# Altium schematic sheet TIDA-010042-E2_Power Stage_Pg3.SchDoc: Power Stage
size 431 x 279 mm; Date: Not shown in title block; ApprovedBy: Not shown in title block; CheckedBy: Not shown in title block; Author: Not shown in title block; CompanyName: Not shown in title block; DrawnBy: Vaibhavi; Engineer: Not shown in title block; Organization: Not shown in title block; Address1: Not shown in title block; Address2: Not shown in title block; Address3: Not shown in title block; Address4: Not shown in title block; DocumentNumber: 1; Revision: Use project parameter SCH_Rev; SheetNumber: 3; SheetTotal: 5; PageSetup: Record=PageOptions|CenterHorizontal=True|CenterVertical=True|PrintScale=1.00|XCorrection=1.00|YCorrection=1.00|PrintKind=0|BorderSize=5000000|LeftOffset=0|BottomOffset=0|Orientation=2|PaperLength=1000|PaperWidth=1000|Scale=100|PaperSource=15|PrintQuality=600|MediaType=1|DitherType=10|PaperKind=Letter|PrintScaleMode=1; CurrentTime: Not shown in title block; CurrentDate: Not shown in title block; Time: Not shown in title block; DocumentFullPathAndName: Not shown in title block; DocumentName: Not shown in title block; ModifiedDate: Not shown in title block; ImagePath: Not shown in title block
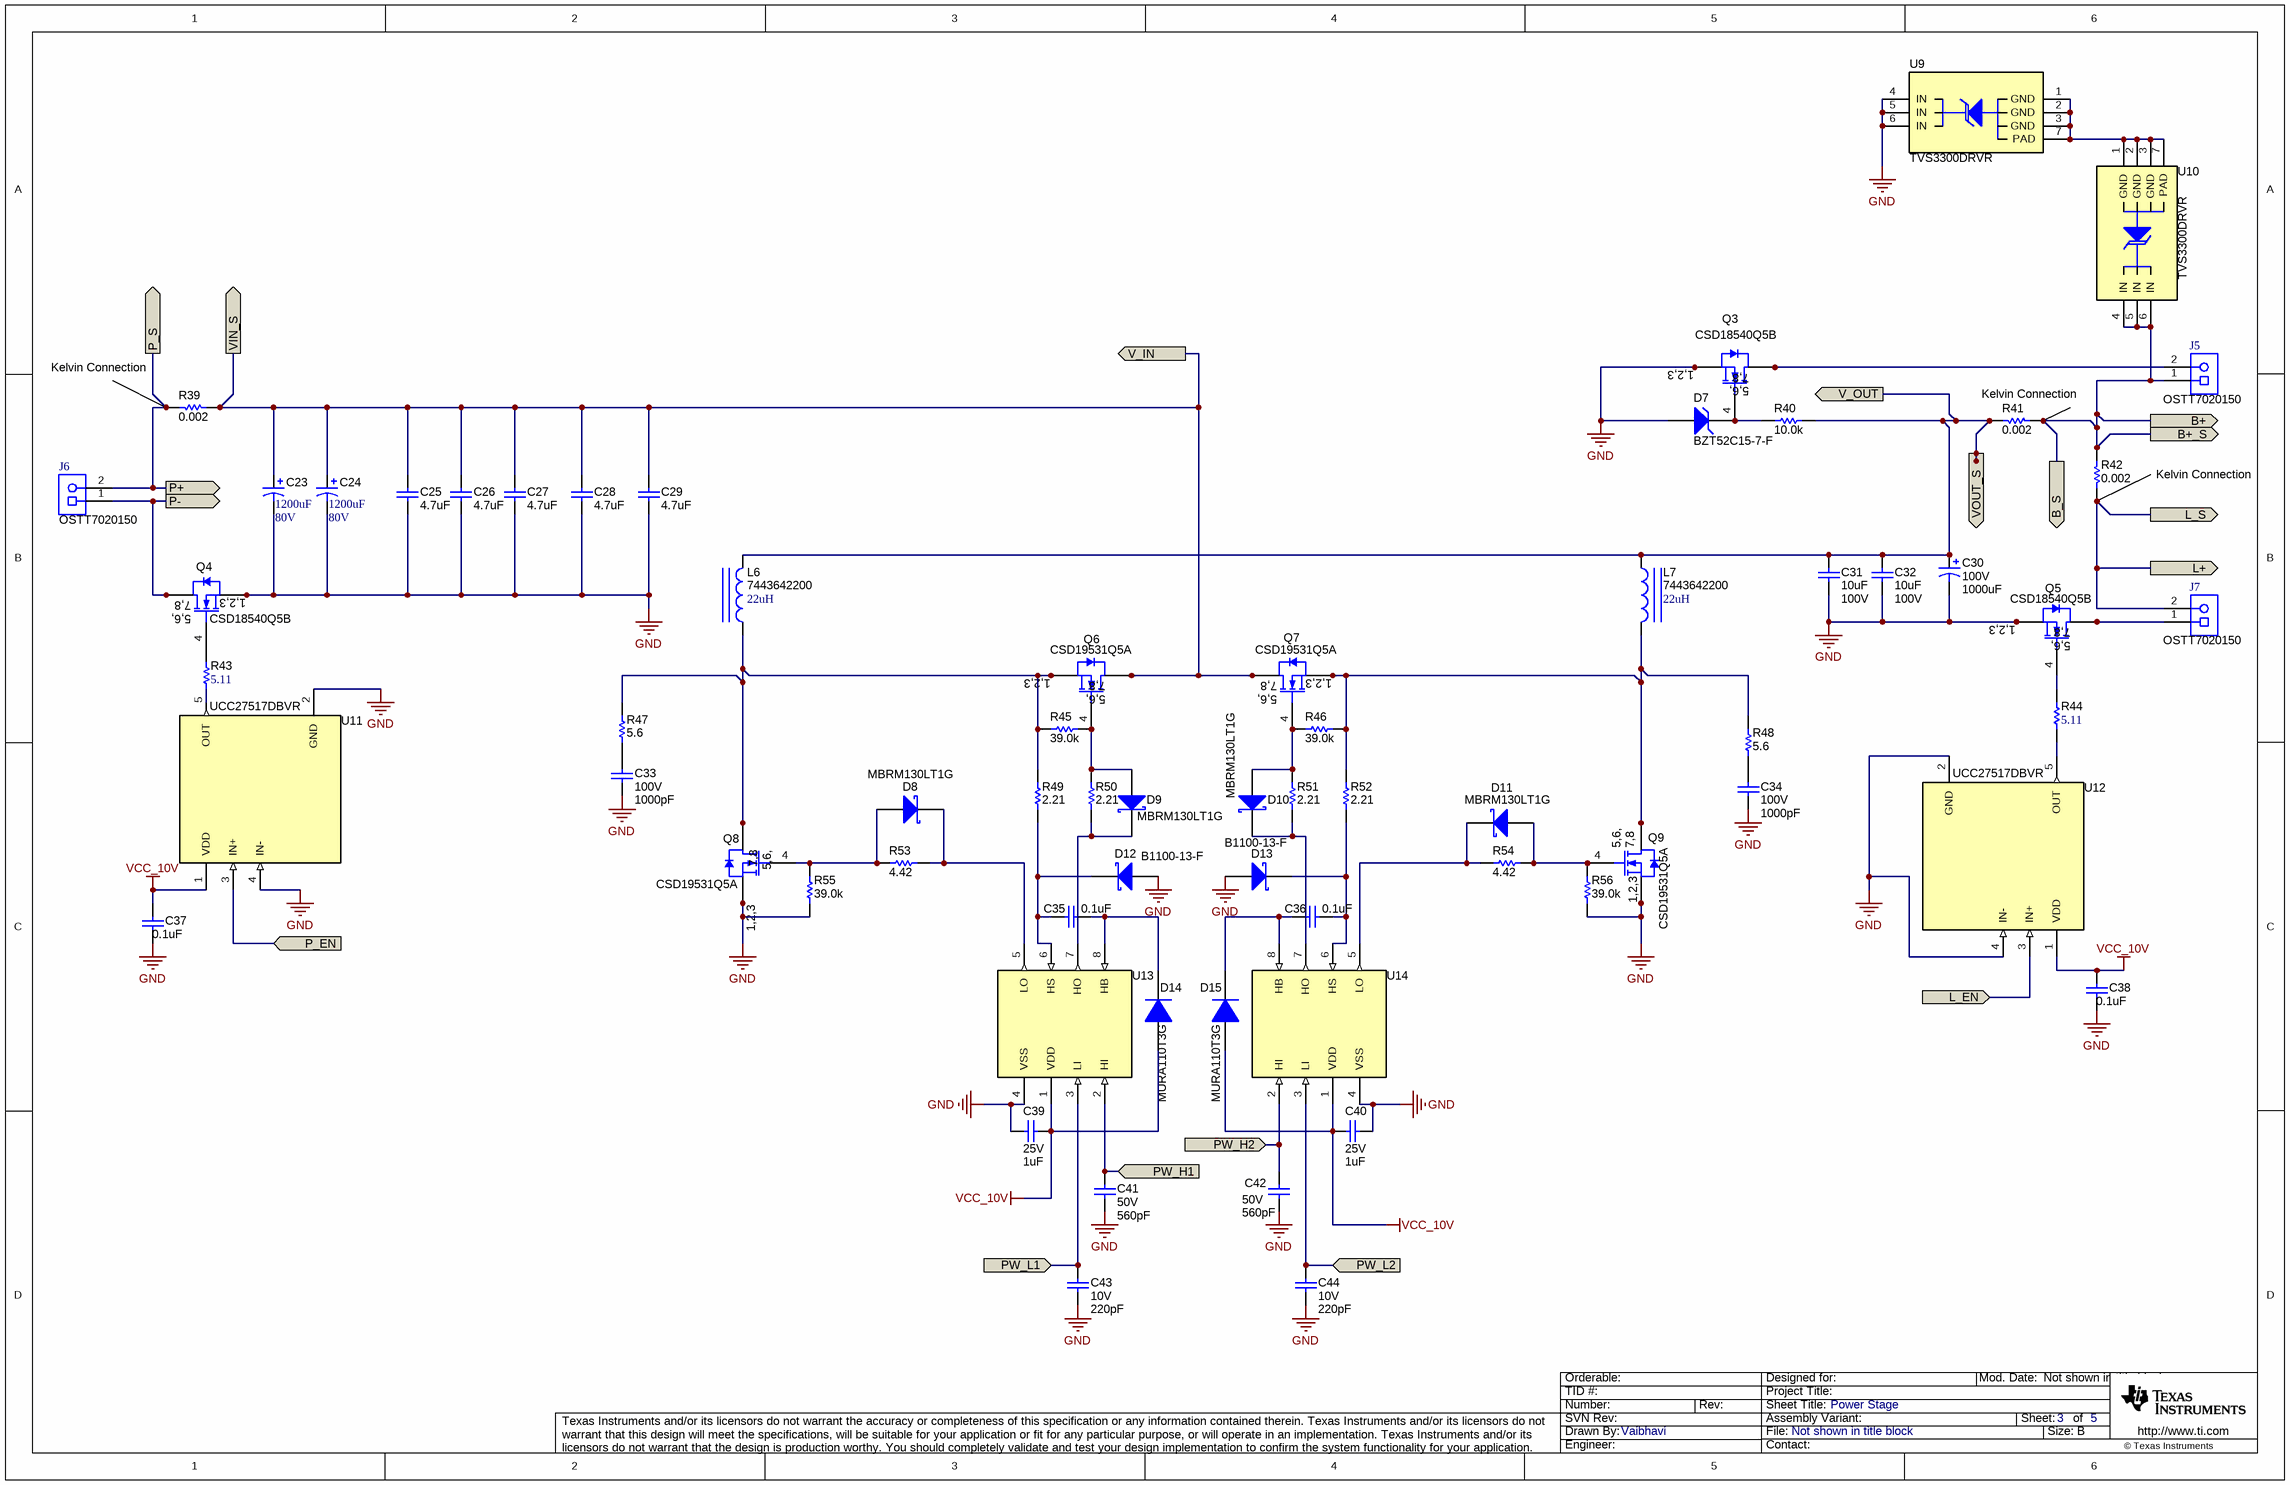
[diagram p0: TIDA-010042-E2_Power Stage_Pg3.SchDoc]

## Parts
C23  value 1200uF  VDC_V: 80V  [KYB_1800x3150]  (hidden comment: EKYB800ELL122MMN3S)
C24  value 1200uF  VDC_V: 80V  [KYB_1800x3150]  (hidden comment: EKYB800ELL122MMN3S)
C25  ValueDisplayed: 4.7uF  [2220_250]  (hidden comment: Capacitor)
C26  ValueDisplayed: 4.7uF  [2220_250]  (hidden comment: Capacitor)
C27  ValueDisplayed: 4.7uF  [2220_250]  (hidden comment: Capacitor)
C28  ValueDisplayed: 4.7uF  [2220_250]  (hidden comment: Capacitor)
C29  ValueDisplayed: 4.7uF  [2220_250]  (hidden comment: Capacitor)
C30  VDC_V: 100V  ValueDisplayed: 1000uF  [VR_1800x4000]  (hidden comment: UVR2A102MHD)
C31  ValueDisplayed: 10uF  VDC_V: 100V  [2220_280]  (hidden comment: 22201C106MAT2A)
C32  ValueDisplayed: 10uF  VDC_V: 100V  [2220_280]  (hidden comment: 22201C106MAT2A)
C33  VDC_V: 100V  ValueDisplayed: 1000pF  [0603]  (hidden comment: 06031C102JAT2A)
C34  VDC_V: 100V  ValueDisplayed: 1000pF  [0603]  (hidden comment: 06031C102JAT2A)
C35  ValueDisplayed: 0.1uF  [0805_HV]  (hidden comment: C0805C104K3RACAUTO)
C36  ValueDisplayed: 0.1uF  [0805_HV]  (hidden comment: C0805C104K3RACAUTO)
C37  ValueDisplayed: 0.1uF  [0603]  (hidden comment: GMK107BJ104KAHT)
C38  ValueDisplayed: 0.1uF  [0603]  (hidden comment: GMK107BJ104KAHT)
C39  VDC_V: 25V  ValueDisplayed: 1uF  [0805_HV]  (hidden comment: 08053C105KAT2A)
C40  VDC_V: 25V  ValueDisplayed: 1uF  [0805_HV]  (hidden comment: 08053C105KAT2A)
C41  VDC_V: 50V  ValueDisplayed: 560pF  [0603]  (hidden comment: C0603C561J5GACTU)
C42  VDC_V: 50V  ValueDisplayed: 560pF  [0603]  (hidden comment: C0603C561J5GACTU)
C43  VDC_V: 10V  ValueDisplayed: 220pF  [0603]  (hidden comment: CL10C221FB8NNNC)
C44  VDC_V: 10V  ValueDisplayed: 220pF  [0603]  (hidden comment: CL10C221FB8NNNC)
D7  BZT52C15-7-F  [SOD-123]
D8  MBRM130LT1G  [POWERMITE]
D9  MBRM130LT1G  [POWERMITE]
D10  MBRM130LT1G  [POWERMITE]
D11  MBRM130LT1G  [POWERMITE]
D12  B1100-13-F  [SMA]
D13  B1100-13-F  [SMA]
D14  MURA110T3G  [SMA]
D15  MURA110T3G  [SMA]
J5  OSTT7020150  [On-Shore_OSTT7020150]
J6  OSTT7020150  [On-Shore_OSTT7020150]
J7  OSTT7020150  [On-Shore_OSTT7020150]
L6  7443642200  ValueDisplayed: 22uH  [WE-HCF_2818]
L7  7443642200  ValueDisplayed: 22uH  [WE-HCF_2818]
Q3  CSD18540Q5B  [DNK0008A]
Q4  CSD18540Q5B  [DNK0008A]
Q5  CSD18540Q5B  [DNK0008A]
Q6  CSD19531Q5A  [DQJ0008A]
Q7  CSD19531Q5A  [DQJ0008A]
Q8  CSD19531Q5A  [DQJ0008A]
Q9  CSD19531Q5A  [DQJ0008A]
R39  ValueDisplayed: 0.002  [LRMA2512_under3]  (hidden comment: CSR2512C0R002F)
R40  ValueDisplayed: 10.0k  [0603]  (hidden comment: Resistor)
R41  ValueDisplayed: 0.002  [LRMA2512_under3]  (hidden comment: CSR2512C0R002F)
R42  ValueDisplayed: 0.002  [LRMA2512_under3]  (hidden comment: CSR2512C0R002F)
R43  value 5.11  [1206]  (hidden comment: CRCW12065R11FKEA)
R44  value 5.11  [1206]  (hidden comment: CRCW12065R11FKEA)
R45  ValueDisplayed: 39.0k  [0805_HV]  (hidden comment: CRCW080539R0JNEA)
R46  ValueDisplayed: 39.0k  [0805_HV]  (hidden comment: CRCW080539R0JNEA)
R47  ValueDisplayed: 5.6  [2512]  (hidden comment: Resistor)
R48  ValueDisplayed: 5.6  [2512]  (hidden comment: Resistor)
R49  ValueDisplayed: 2.21  [0805_HV]  (hidden comment: CRCW08052R21FKEA)
R50  ValueDisplayed: 2.21  [0805_HV]  (hidden comment: CRCW08052R21FKEA)
R51  ValueDisplayed: 2.21  [0805_HV]  (hidden comment: CRCW08052R21FKEA)
R52  ValueDisplayed: 2.21  [0805_HV]  (hidden comment: CRCW08052R21FKEA)
R53  ValueDisplayed: 4.42  [0805_HV]  (hidden comment: RC0805FR-074R42L)
R54  ValueDisplayed: 4.42  [0805_HV]  (hidden comment: RC0805FR-074R42L)
R55  ValueDisplayed: 39.0k  [0805_HV]  (hidden comment: CRCW080539R0JNEA)
R56  ValueDisplayed: 39.0k  [0805_HV]  (hidden comment: CRCW080539R0JNEA)
U9  TVS3300DRVR  [DRV0006A]
U10  TVS3300DRVR  [DRV0006A]
U11  UCC27517DBVR  [DBV0005A_N]
U12  UCC27517DBVR  [DBV0005A_N]
U13  LM5109BMA/NOPB  [D0008A_N]  (value not drawn)
U14  LM5109BMA/NOPB  [D0008A_N]  (value not drawn)

## Ports
B+ (out), B+_S (out), B_S (out), L+ (out), L_EN (in), L_S (out), P+ (out), P- (out), P_EN (in), P_S (out), PW_H1 (in), PW_H2 (in), PW_L1 (in), PW_L2 (in), V_IN (out), V_OUT (out), VIN_S (out), VOUT_S (out)

## Nets
GND: C23.2(-) C24.2(-) C25.2 C26.2 C27.2 C28.2 C29.2 C30.2(-) C31.2 C32.2 C33.2 C34.2 C37.2 C38.2 C39.2 C40.1 C41.2 C42.2 C43.2 C44.2 D7.2(A) D12.2(A) D13.2(A) Q3.1(S) Q3.2(S) Q3.3(S) Q4.1(S) Q4.2(S) Q4.3(S) Q5.1(S) Q5.2(S) Q5.3(S) Q8.1(S) Q8.2(S) Q8.3(S) Q9.1(S) Q9.2(S) Q9.3(S) R55.1 R56.2 U9.4(IN) U9.5(IN) U9.6(IN) U11.2(GND) U11.4(IN-) U12.2(GND) U12.4(IN-) U13.4(VSS) U14.4(VSS)
VCC_10V: C37.1 C38.1 C39.1 C40.2 D14.2(A) D15.2(A) U11.1(VDD) U12.1(VDD) U13.1(VDD) U14.1(VDD)
B+: J5.1 R41.2 R42.2 U10.4(IN) U10.5(IN) U10.6(IN) ; port B+, port B+_S, port B_S
L+: J7.2 R42.1 ; port L+, port L_S
L_EN: U12.3(IN+) ; port L_EN
P+: J6.2 R39.2 ; port P+, port P_S
P-: J6.1 Q4.5(D) Q4.6(D) Q4.7(D) Q4.8(D) Q4.9(D) ; port P-
P_EN: U11.3(IN+) ; port P_EN
PW_H1: C41.1 U13.2(HI) ; port PW_H1
PW_H2: C42.1 U14.2(HI) ; port PW_H2
PW_L1: C43.1 U13.3(LI) ; port PW_L1
PW_L2: C44.1 U14.3(LI) ; port PW_L2
V_IN: C23.1(+) C24.1(+) C25.1 C26.1 C27.1 C28.1 C29.1 Q6.5(D) Q6.6(D) Q6.7(D) Q6.8(D) Q6.9(D) Q7.5(D) Q7.6(D) Q7.7(D) Q7.8(D) Q7.9(D) R39.1 ; port V_IN, port VIN_S
V_OUT: C30.1(+) C31.1 C32.1 L6.2 L7.1 R40.2 R41.1 ; port V_OUT, port VOUT_S
NetC33_1: C33.1 R47.1
NetC34_1: C34.1 R48.1
NetC35_1: C35.1 D14.1(K) U13.8(HB)
NetC35_2: C35.2 D12.1(K) R49.1 U13.6(HS)
NetC36_1: C36.1 D13.1(K) R52.1 U14.6(HS)
NetC36_2: C36.2 D15.1(K) U14.8(HB)
NetD7_1: D7.1(K) Q3.4(G) R40.1
NetD8_1: D8.1(K) R53.2 U13.5(LO)
NetD8_2: D8.2(A) Q8.4(G) R53.1 R55.2
NetD9_1: D9.1(K) R50.1 U13.7(HO)
NetD9_2: D9.2(A) Q6.4(G) R45.1 R50.2
NetD10_1: D10.1(K) R51.1 U14.7(HO)
NetD10_2: D10.2(A) Q7.4(G) R46.2 R51.2
NetD11_1: D11.1(K) R54.1 U14.5(LO)
NetD11_2: D11.2(A) Q9.4(G) R54.2 R56.1
NetJ5_2: J5.2 Q3.5(D) Q3.6(D) Q3.7(D) Q3.8(D) Q3.9(D)
NetJ7_1: J7.1 Q5.5(D) Q5.6(D) Q5.7(D) Q5.8(D) Q5.9(D)
NetL6_1: L6.1 Q6.1(S) Q6.2(S) Q6.3(S) Q8.5(D) Q8.6(D) Q8.7(D) Q8.8(D) Q8.9(D) R45.2 R47.2 R49.2
NetL7_2: L7.2 Q7.1(S) Q7.2(S) Q7.3(S) Q9.5(D) Q9.6(D) Q9.7(D) Q9.8(D) Q9.9(D) R46.1 R48.2 R52.2
NetQ4_4: Q4.4(G) R43.2
NetQ5_4: Q5.4(G) R44.2
NetR43_1: R43.1 U11.5(OUT)
NetR44_1: R44.1 U12.5(OUT)
NetU9_1: U9.1(GND) U9.2(GND) U9.3(GND) U9.7(PAD) U10.1(GND) U10.2(GND) U10.3(GND) U10.7(PAD)

## Notes on the sheet
- (near R39) Kelvin Connection
- (near R41) Kelvin Connection
- Kelvin Connection
- Drawn By:
- SVN Rev:
- Number:
- TID #:
- Orderable:
- Rev:
- Sheet Title:
- File:
- Project Title:
- Designed for:
- Assembly Variant:
- Mod. Date:
- Sheet:
- Size:
- of
- B
- http://www.ti.com
- Texas Instruments and/or its licensors do not warrant the accuracy or completeness of this specification or any information contained therein. Texas Instruments and/or its licensors do not warrant that this design will meet the specifications, will be suitable for your application or fit for any particular purpose, or will operate in an implementation. Texas Instruments and/or its licensors do not warrant that the design is production worthy. You should completely validate and test your design implementation to confirm the system functionality for your application.
- Engineer:
- Contact:
- © Texas Instruments
- (in symbol CMP-0000823-2) 7,8; 1,2,3; 5,6,
- (in symbol CMP-0000956-2) 7,8; 5,6,; 1,2,3

## Library data of the parts
C23 C24 = CMP-0009878-2: CAP, AL, 1200 uF, 80 V, +/- 20%, 0.02 ohm, TH; Manufacturer: Chemi-Con; TaMin_C: -40°C; ESR_ohm: 0.02; Polarized: Y; SizeAreaWB_mm2: 400; U/M: EA; TaMax_C: 105°C; SizeZ_mm: 33; SizeX_mm: 18; Cap_Case: 18x31.5; SizeArea_mm2: 324; CompType: Capacitor; AEC Qualified: N; Cap_F: 1.2mF; IRMS_A: 2.55A; AEC Category: Q200; Supplier Part Number 2: 54X2482; Publisher: Texas Instruments; Supplier 2: Newark; Supplier Part Number 3: 661-EKYB800E122MMN3S; Supplier 3: Mouser; RoHS: Y; Value1: 0.02 ohm; MountType: TH; Supplier 1: Digi-Key; PackageReference: D18xL31.5mm; Tolerance_%: 20%; SizeY_mm: 18; Value2: 80V; LatestRevisionDate: 2017-03-09; PartNumber: EKYB800ELL122MMN3S; Series: KYB; ComponentLink1Description: Datasheet link; AEC Grade: N/A; Supplier Part Number 1: 565-4004-ND; Technology: AL; ValueDisplayed: 1200uF; ComponentLink1URL: http://www.chemi-con.co.jp/e/catalog/pdf/al-e/al-sepa-e/004-lead/al-kyb-e-140701.pdf
C25-C29 = CMP-0009414-2: CAP, CERM, 4.7 uF, 100 V, +/- 20%, X7R, AEC-Q200 Grade 1,; PartNumber: CGA9N2X7R2A475M230KA; Manufacturer: TDK; Polarized: N; Value: 4.7uF; U/M: EA; Cap_F: 4.7µF; Value1: Unknown; VDC_V: 100V; TaMin_C: -55°C; TaMax_C: 125°C; Cap_Case: 2220; SizeArea_mm2: 28.5; SizeAreaWB_mm2: 53.9; SizeX_mm: 5.7; SizeY_mm: 5; SizeZ_mm: 2.5; AEC Category: Q200; AEC Qualified: Y; AEC Grade: 1; CompType: Capacitor; RoHS: Y; Tolerance_%: 20%; Value2: 100V; MountType: SMT; Technology: Ceramic; TempCo: X7R; Published: 2008-06-19; Publisher: Texas Instruments; LatestRevisionDate: 2017-03-09; ComponentLink1Description: Datasheet link; ComponentLink1URL: https://product.tdk.com/info/en/documents/chara_sheet/CGA9N2X7R2A475M230KA.pdf; Supplier 1: Digi-Key; Supplier Part Number 1: 445-13141-1-ND; Supplier 2: Newark; Supplier Part Number 2: 51X7619; Supplier 3: Mouser; Supplier Part Number 3: 810-CGA9N2X7R2A475MA
C30 = CMP-0009935-2: CAP, AL, 1000 uF, 100 V, +/- 20%, TH; Manufacturer: Nichicon; TaMin_C: -40°C; Polarized: Y; SizeAreaWB_mm2: 400; Value1: Unknown; U/M: EA; Value: 1000uF; TaMax_C: 85°C; SizeZ_mm: 42; SizeX_mm: 18; Cap_Case: 18x40; SizeArea_mm2: 324; CompType: Capacitor; AEC Qualified: N; Cap_F: 1mF; IRMS_A: 1.38A; AEC Category: Q200; Supplier Part Number 2: 55K2183; Publisher: Texas Instruments; Supplier 2: Newark; Supplier Part Number 3: 647-UVR2A102MHD; Supplier 3: Mouser; RoHS: Y; MountType: TH; Supplier 1: Digi-Key; PackageReference: D18xL40mm; Tolerance_%: 20%; SizeY_mm: 18; Value2: 100V; LatestRevisionDate: 2017-03-09; PartNumber: UVR2A102MHD; Series: VR; ComponentLink1Description: Datasheet link; AEC Grade: N/A; Supplier Part Number 1: 493-1152-ND; Technology: AL; ComponentLink1URL: http://nichicon-us.com/english/products/pdfs/e-uvr.pdf
C31 C32 = CMP-0009304-2: CAP, CERM, 10 uF, 100 V, +/- 20%, X7R, 2220; Manufacturer: AVX; Polarized: N; Value: 10uF; U/M: EA; Cap_F: 10µF; Value1: Unknown; TaMin_C: -55°C; TaMax_C: 125°C; Cap_Case: 2220; SizeArea_mm2: 28.5; SizeAreaWB_mm2: 53.9; SizeX_mm: 5.7; SizeY_mm: 5; SizeZ_mm: 2.8; AEC Category: Q200; CompType: Capacitor; PartNumber: 22201C106MAT2A; PackageReference: 2220; RoHS: Y; Tolerance_%: 20%; Value2: 100V; MountType: SMT; Technology: Ceramic; TempCo: X7R; Published: 2008-06-19; Publisher: Texas Instruments; LatestRevisionDate: 2017-03-09; ComponentLink1Description: Datasheet link; ComponentLink1URL: http://datasheets.avx.com/X7RDielectric.pdf; Supplier 1: Digi-Key; Supplier Part Number 1: 478-9622-1-ND; Supplier 2: Mouser; Supplier Part Number 2: 581-22201C106MAT2A; AEC Qualified: N; AEC Grade: N/A
C33 C34 = CMP-0006723-4: CAP, CERM, 1000 pF, 100 V, +/- 5%, X7R, 0603; Manufacturer: AVX; TaMin_C: -55°C; ESR_ohm: 2.76d; Polarized: N; SizeAreaWB_mm2: 4.68; Value1: 0.276 ohm; U/M: EA; Value: 1000pF; TaMax_C: 125°C; SizeZ_mm: 1; SizeX_mm: 1.6; SizeY_mm: 0.8; SizeArea_mm2: 1.28; Cap_F: 1nF; AEC Category: Q200; Supplier Part Number 2: 96M1234; Publisher: Texas Instruments; Supplier 2: Newark; Supplier Part Number 3: 581-06031C102J; TempCo: X7R; Supplier 3: Mouser; Published: 2008-06-19; RoHS: Y; MountType: SMT; Supplier 1: Digi-Key; PackageReference: 0603; Tolerance_%: 5%; Cap_Case: 0603; Value2: 100V; CompType: Capacitor; LatestRevisionDate: 2017-03-09; PartNumber: 06031C102JAT2A; AEC Qualified: N; ComponentLink1Description: Datasheet link; AEC Grade: N/A; Supplier Part Number 1: 478-3698-1-ND; Technology: Ceramic; ComponentLink1URL: http://datasheets.avx.com/X7RDielectric.pdf
C35 C36 = CMP-0007567-2: CAP CER 0.1UF 16V X7R 0805; Manufacturer: Wurth Electronics Inc.; PartNumber: 885012207045; TaMin_C: -55°C; ESR_ohm: 2.8d; Polarized: N; SizeAreaWB_mm2: 6.75; Value1: 0.28 ohm; U/M: EA; TaMax_C: 125°C; Tolerance_%: 10%; SizeZ_mm: 1.45; SizeX_mm: 2; SizeY_mm: 1.25; Cap_Case: 0805; Value2: 25V; SizeArea_mm2: 2.5; CompType: Capacitor; Cap_F: 100nF; AEC Category: Q200; Publisher: Texas Instruments; TempCo: X7R; Published: 2008-06-19; RoHS: Y; MountType: SMT; Value: 0.1uF; Supplier 1: Digi-Key; PackageReference: 0805; LatestRevisionDate: 2017-03-09; AEC Qualified: N; VDC_V: 16V; ComponentLink1Description: Datasheet link; AEC Grade: N/A; Supplier Part Number 1: 732-8045-1-ND; Technology: Ceramic; ComponentLink1URL: http://datasheets.avx.com/X7RDielectric.pdf
C37 C38 = CMP-0007044-5: CAP CER 0.1UF 25V X5R 0603; Manufacturer: Taiyo Yuden; PartNumber: TMK107BJ104KA-T; TaMin_C: -55°C; ESR_ohm: 0.0296; Polarized: N; TempCo: X7R; SizeAreaWB_mm2: 4.68; Value1: 0.0296 ohm; U/M: EA; TaMax_C: 125°C; Tolerance_%: 10%; SizeZ_mm: 1; SizeX_mm: 1.6; SizeY_mm: 0.8; SizeArea_mm2: 1.28; CompType: Capacitor; Cap_F: 100nF; IRMS_A: 9.7199dA; AEC Category: Q200; Publisher: Texas Instruments; Published: 2008-06-19; RoHS: Y; MountType: SMT; Value: 0.1uF; Supplier 1: Digi-Key; PackageReference: 0603; Cap_Case: 0603; Value2: 25V; LatestRevisionDate: 2017-03-09; AEC Qualified: N; VDC_V: 25V; ComponentLink1Description: Datasheet link; AEC Grade: N/A; Supplier Part Number 1: 587-1245-1-ND; Technology: Ceramic; ComponentLink1URL: https://product.tdk.com/en/search/capacitor/ceramic/mlcc/info?part_no=C1608X7R1H104K080AA
C39 C40 = CMP-0007728-2: CAP CER 1UF 25V X7R 0805; Manufacturer: Wurth Electronics Inc.; PartNumber: 885012207078; TaMin_C: -55°C; Polarized: N; SizeAreaWB_mm2: 6.75; Value1: Unknown; U/M: EA; TaMax_C: 125°C; Tolerance_%: 10%; SizeZ_mm: 1.45; SizeX_mm: 2; SizeY_mm: 1.25; Cap_Case: 0805; SizeArea_mm2: 2.5; CompType: Capacitor; Cap_F: 1µF; AEC Category: Q200; Publisher: Texas Instruments; TempCo: X7R; Published: 2008-06-19; RoHS: Y; MountType: SMT; Value: 1uF; Supplier 1: Digi-Key; PackageReference: 0805; Value2: 25V; LatestRevisionDate: 2017-03-09; AEC Qualified: ?; ComponentLink1Description: Datasheet link; Supplier Part Number 1: 732-7672-1-ND; Technology: Ceramic; ComponentLink1URL: http://capacitoredge.kemet.com/capedge2/DataSheet/Datasheet-C0805C105K3RACTU.pdf?pn=C0805C105K3RACTU
C41 C42 = CMP-0006953-4: CAP, CERM, 560 pF, 50 V, +/- 5%, C0G/NP0, 0603; Manufacturer: Kemet; TaMin_C: -55°C; Polarized: N; SizeAreaWB_mm2: 4.68; Value1: Unknown; U/M: EA; Value: 560pF; TaMax_C: 125°C; SizeZ_mm: 1; SizeX_mm: 1.6; SizeY_mm: 0.8; SizeArea_mm2: 1.28; AEC Category: Q200; Supplier Part Number 2: 80-C0603C561J5G; Publisher: Texas Instruments; Supplier 2: Mouser; Supplier Part Number 3: 1414646; TempCo: C0G/NP0; Supplier 3: Farnell; Published: 2008-06-19; RoHS: Y; MountType: SMT; Supplier 1: Digi-Key; PackageReference: 0603; Tolerance_%: 5%; Cap_Case: 0603; Value2: 50V; CompType: Capacitor; LatestRevisionDate: 2017-03-09; PartNumber: C0603C561J5GACTU; AEC Qualified: ?; Cap_F: 560pF; ComponentLink1Description: Datasheet link; Supplier Part Number 1: 399-3287-1-ND; Technology: Ceramic; ComponentLink1URL: http://www.kemet.com/kemet/web/homepage/kechome.nsf/vapubfiles/F3102_Y5V.pdf/$file/F3102_Y5V.pdf
C43 C44 = CMP-0007197-4: CAP CER 220PF 10V C0G/NP0 0603; Manufacturer: Wurth Electronics Inc.; PartNumber: 885012006010; TaMin_C: -55°C; Polarized: N; SizeAreaWB_mm2: 4.68; Value1: Unknown; U/M: EA; TaMax_C: 125°C; Tolerance_%: 5%; SizeZ_mm: 1; SizeX_mm: 1.6; SizeY_mm: 0.8; SizeArea_mm2: 1.28; CompType: Capacitor; AEC Category: Q200; Publisher: Texas Instruments; TempCo: C0G/NP0; Published: 2008-06-19; RoHS: Y; MountType: SMT; Value: 220pF; Supplier 1: Digi-Key; PackageReference: 0603; Cap_Case: 0603; Value2: 10V; LatestRevisionDate: 2017-03-09; AEC Qualified: ?; Cap_F: 220pF; ComponentLink1Description: Datasheet link; Supplier Part Number 1: 732-7754-1-ND; Technology: Ceramic; ComponentLink1URL: http://search.murata.co.jp/Ceramy/PnsearchViewAction.do?HnOFG=ON&HnNFG=ON&SEL_CNT=50&sLang=en&sKey=GRM1885C1H221JA01D&x=9&y=9&search=startwith
D7 = CMP-0005768-2: Diode, Zener, 15 V, 370 mW, AEC-Q101, SOD-123; Manufacturer: Diodes Inc.; Power_W: 370mW; SizeAreaWB_mm2: 13.095; Vz_V: 15V; Value1: 0.37W; RJA_CperW: 338; U/M: EA; Value: 15V; SizeZ_mm: 1.35; SizeX_mm: 3.85; SizeY_mm: 1.7; SizeArea_mm2: 6.545; AEC Qualified: Y; AEC Category: Q101; Supplier Part Number 2: 12T1445; Publisher: Texas Instruments; Supplier 2: Newark; Supplier Part Number 3: 621-BZT52C15-F; Supplier 3: Mouser; Published: 2008-10-08; RoHS: Y; MountType: SMT; Supplier 1: Digi-Key; LatestRevisionNote: Updated Supplier Data; PackageReference: SOD-123; CompType: Zener; LatestRevisionDate: 2017-03-09; PartNumber: BZT52C15-7-F; ComponentLink1Description: Datasheet link; Supplier Part Number 1: BZT52C15-FDICT-ND; ComponentLink1URL: http://www.diodes.com/_files/datasheets/ds18004.pdf
D8-D11 = CMP-0077056-1: Diode, Schottky, 30 V, 1 A, POWERMITE; Manufacturer: ON Semiconductor; SizeAreaWB_mm2: 14.945; Vr_V: 30V; SizeArea_mm2: 7.995; TJmax_C: 125°C; AEC Category: Q101; Value: 30V; SizeZ_mm: 1.15; Green_REACh: Incomplete; Io_A: 1A; Vf_V: 3.8dV; SizeY_mm: 2.05; Value2: 0.38V; Green_Lifecycle: Not Set; U/M: EA; SizeX_mm: 3.9; ComponentLink1Description: Datasheet link; RoHS: Y; Supplier Part Number 3: 863-MBRM130LT1G; Supplier 1: Digi-Key; AEC Qualified: ?; Green_EU RoHS: Incomplete; PackageReference: POWERMITE; PartNumber: MBRM130LT1G; Publisher: Texas Instruments; Supplier Part Number 2: 98H0593; Supplier 2: Newark; Published: 2008-06-26; LatestRevisionDate: 2017-07-25; ComponentLink1URL: http://www.onsemi.com/pub_link/Collateral/MBRM130L-D.PDF; Value1: 1A; CompType: Diode; MountType: SMT; Supplier Part Number 1: MBRM130LT1GOSCT-ND; Supplier 3: Mouser; Type: Schottky; Green_EU RoHS-2: Incomplete
D12 D13 = CMP-0028371-1: Diode, Schottky, 100 V, 1 A, SMA; Manufacturer: Diodes Inc.; Io_A: 1A; Green_Lifecycle: Active; SizeAreaWB_mm2: 37.3428; Vr_V: 100V; Green_REACh: Passed; TJmax_C: 150°C; U/M: EA; Value: 100V; SizeZ_mm: 2.87; SizeX_mm: 5.59; SizeY_mm: 2.92; Vf_V: 7.9dV; Value2: 0.79V; SizeArea_mm2: 16.3228; AEC Category: Q101; RJC_CperW: 25; ComponentLink1URL: http://www.diodes.com/datasheets/ds30018.pdf; Supplier Part Number 2: 621-B1100-F; Publisher: Texas Instruments; Supplier 2: Mouser; Supplier Part Number 3: 1858611; Supplier 3: Farnell; Published: 2008-06-26; RoHS: Y; Value1: 1A; MountType: SMT; Green_EU RoHS-2: Passed; Supplier 1: Digi-Key; Green_EU RoHS: Passed with Exemption; PackageReference: SMA; CompType: Diode; Type: Schottky; LatestRevisionDate: 2017-05-08; PartNumber: B1100-13-F; AEC Qualified: ?; ComponentLink1Description: Datasheet link; Supplier Part Number 1: B1100-FDICT-ND
D14 D15 = CMP-0029196-1: Diode, Ultrafast, 100 V, 2 A, SMA; Manufacturer: ON Semiconductor; Io_A: 2A; Green_Lifecycle: Active; SizeAreaWB_mm2: 37.3428; Vr_V: 100V; Green_REACh: Passed; TJmax_C: 175°C; U/M: EA; Value: 100V; SizeZ_mm: 2.87; SizeX_mm: 5.59; SizeY_mm: 2.92; SizeArea_mm2: 16.3228; AEC Qualified: N; AEC Category: Q101; ComponentLink1URL: http://www.onsemi.com/pub/Collateral/MURA105T3-D.PDF; Supplier Part Number 2: 67R1385; Publisher: Texas Instruments; Supplier 2: Newark; Supplier Part Number 3: 863-MURA110T3G; Supplier 3: Mouser; Published: 2008-06-26; RoHS: Y; Value1: 2A; MountType: SMT; Green_EU RoHS-2: Passed; Supplier 1: Digi-Key; Green_EU RoHS: Passed with Exemption; PackageReference: SMA; Value2: V; CompType: Diode; Type: Ultrafast; LatestRevisionDate: 2017-05-08; PartNumber: MURA110T3G; ComponentLink1Description: Datasheet link; Supplier Part Number 1: MURA110T3GOSCT-ND
J5-J7 = CMP-0075360-1: Terminal Block, 6.35mm, 2x1, TH; Manufacturer: On-Shore Technology; CNHeader: False; Current_A: 30A; Gender: Female; Cert_CULUS: Y; Voltage_V: 300V; Row_Count: 1; Pitch_mm: 6.35; CT: True; ComponentLink1URL: http://www.on-shore.com/wp-content/uploads/2015/09/OSTT7XX0150.pdf; Publisher: Texas Instruments; Color: Green; RoHS: Y; MountType: TH; Supplier 1: Digi-Key; PackageReference: On-Shore_OSTT7020150; PinCount: 2; CompType: Terminal Block; LatestRevisionDate: 2017-07-12; PartNumber: OSTT7020150; Orientation: R/A; ComponentLink1Description: Datasheet URL; Supplier Part Number 1: ED2675-ND; Cert_UL: Y
L6 L7 = CMP-0064487-2: Inductor, Shielded, Ferrite, 22 uH, 18 A, 0.00264 ohm, SMD; Manufacturer: Wurth Elektronik; Isat: 18A @ 20% inductance drop; Irms: 30A @ 50C rise; SizeAreaWB_mm2: 655.75; DCR_ohm: 2.64m; Value: 22uH; Imax_A: 18A; SizeZ_mm: 18.5; SizeX_mm: 28.5; SizeY_mm: 19.5; SizeArea_mm2: 555.75; Ind_H: 22µH; AEC Qualified: N; AEC Category: Q200; Supplier Part Number 2: 75X1206; Publisher: Texas Instruments; Supplier 2: Newark; Supplier Part Number 3: 710-7443642200; Supplier 3: Mouser; Published: 2008-06-26; RoHS: Y; Value1: 0.00264 ohm; Material: Ferrite; MountType: SMT; Supplier 1: Digi-Key; PackageReference: 28.5x19.5mm; Value2: 18A; CompType: Inductor; LatestRevisionDate: 2017-06-02; PartNumber: 7443642200; ComponentLink1Description: Datasheet link; AEC Grade: N/A; Supplier Part Number 1: 732-5628-ND; Technology: Shielded; ComponentLink1URL: http://katalog.we-online.de/pbs/datasheet/7443642200.pdf
Q3-Q5 = CMP-0000823-2: MOSFET, N-CH, 60 V, 100 A, DNK0008A (VSON-CLIP-8); Alternate Manufacturer: None; Manufacturer: Texas Instruments; SizeZ_mm: 1; ChType: N; Value2: 41 nC; Value1: 0.003; VdsMax_V: 60V; SizeX_mm: 6; SizeY_mm: 5; Vgs_V: 20V; Value: 60V; Rdson45_ohm: 3.3m; SizeArea_mm2: 30; AEC Category: Q101; IdsMax_A: 100A; SizeAreaWB_mm2: 56; U/M: EA; QgTyp_nC: 41; Supplier 2: Mouser; Supplier 1: Digi-Key; Supplier Part Number 1: 296-41076-1-ND; Supplier Part Number 2: 595-CSD18540Q5B; PartNumber: CSD18540Q5B; ComponentLink1Description: Datasheet link; ComponentLink1URL: http://www.ti.com/lit/ds/symlink/csd18540q5b.pdf; CompType: MOSFET; PackageReference: DNK0008A; AEC Qualified: N; RoHS: Y; MountType: SMT
Q6-Q9 = CMP-0000956-2: MOSFET, N-CH, 100 V, 16 A, DQJ0008A (VSONP-8); Alternate Manufacturer: None; Manufacturer: Texas Instruments; SizeZ_mm: 1.1; ChType: N; Value2: 36 nC; VdsMax_V: 100V; SizeX_mm: 6; SizeY_mm: 4.9; Vgs_V: 20V; QgTyp_nC: 36; Value: 100V; SizeArea_mm2: 29.4; AEC Category: Q101; IdsMax_A: 16A; SizeAreaWB_mm2: 55.2; U/M: EA; Supplier 1: Digi-Key; Supplier Part Number 1: 296-37749-1-ND; PartNumber: CSD19531Q5A; ComponentLink1Description: Datasheet link; LatestRevisionDate: 2017-03-09; CompType: MOSFET; LatestRevisionNote: Added parts.; Publisher: Texas Instruments; AEC Qualified: N; Published: 2008-06-19; RoHS: Y; PackageReference: DQJ0008A; MountType: SMT; ComponentLink1URL: http://www.ti.com/lit/ds/symlink/csd19531q5a.pdf
R39 R41 R42 = CMP-0015826-2: RES 0.002 OHM 1% 3W 2512; Manufacturer: Bourns Inc.; PartNumber: CRE2512-FZ-R002E-3; TempCo: 50 ppm/C; Value_Code: 2L000; U/M: EA; Value: 0.002; Res_ohm: 2m; CompType: Resistor; AEC Qualified: Y; AEC Grade: 0; AEC Category: Q200; Power_W: 3W; Publisher: Texas Instruments; Published: 2008-06-26; RoHS: Y; Value1: 1%; MountType: SMT; Supplier 1: Digi-Key; PackageReference: 2512; Tolerance_%: 1%; Value2: 3W; LatestRevisionDate: 2017-03-09; ComponentLink1Description: Datasheet link; Supplier Part Number 1: CRE2512-FZ-R002E-3CT-ND; Technology: Metal Element; ComponentLink1URL: http://www.ttelectronicsresistors.com/datasheets/LRMA.pdf
R40 = CMP-0023404-3: RES, 10.0 k, 0.1%, 0.1 W, 0603; PartNumber: RG1608P-103-B-T5; Manufacturer: Susumu Co Ltd; Value: 10.0k; Res_ohm: 10k; Value_Code: 10k0; Power_W: 100mW; Value2: 0.1W; VDC_V: 75V; TempCo: 25 ppm/C; SizeArea_mm2: 1.28; SizeX_mm: 1.6; SizeY_mm: 0.8; SizeZ_mm: 1; EIA_Code: E192; U/M: EA; AEC Category: Q200; CompType: Resistor; PackageReference: 0603; RoHS: Y; Tolerance_%: 0.1%; Value1: 0.1%; MountType: SMT; Technology: Metal Film; Published: 2008-06-26; Publisher: Texas Instruments; LatestRevisionDate: 2017-03-09; ComponentLink1Description: Datasheet link; ComponentLink1URL: http://www.susumu.co.jp/english/pdf/products-j01-01.pdf; Supplier 1: Digi-Key; Supplier Part Number 1: RG16P10.0KBCT-ND; Supplier 2: Mouser; Supplier Part Number 2: 754-RG1608P-103-B-T5; Supplier 3: Farnell; Supplier Part Number 3: 1797079; AEC Qualified: ?
R43 R44 = CMP-0017092-3: RES, 5.11, 1%, 0.25 W, AEC-Q200 Grade 0, 1206; Manufacturer: Vishay-Dale; Power_W: 250mW; TempCo: 100 ppm/C; Value_Code: 5R11; EIA_Code: E96; SizeX_mm: 3.2; SizeY_mm: 1.6; SizeZ_mm: 1.35; Value2: 0.25W; SizeArea_mm2: 5.12; AEC Qualified: Y; VDC_V: 200V; AEC Category: Q200; CompType: Resistor; AEC Grade: 0; Supplier Part Number 2: 71-CRCW12065R11FKEA; Supplier 2: Mouser; RoHS: E; Value1: 1%; MountType: SMT; Supplier 1: Digi-Key; PackageReference: 1206; Tolerance_%: 1%; Res_ohm: 5.11; PartNumber: CRCW12065R11FKEA; ComponentLink1Description: Datasheet link; Supplier Part Number 1: 541-5.11FFCT-ND; Technology: Thick Film; ValueDisplayed: 5.11; ComponentLink1URL: http://www.vishay.com/docs/20035/dcrcwe3.pdf
R45 R46 R55 R56 = CMP-0021860-2: RES, 39.0 k, 1%, 0.2 W, 0805; Manufacturer: Vishay-Dale; Power_W: 200mW; TempCo: 50 ppm/C; Value_Code: 39k0; U/M: EA; Value: 39.0k; Res_ohm: 39k; SizeX_mm: 2; SizeY_mm: 1.25; SizeZ_mm: 1.45; Value2: 0.2W; SizeArea_mm2: 2.5; CompType: Resistor; AEC Qualified: N; VDC_V: 150V; AEC Category: Q200; Publisher: Texas Instruments; Published: 2008-06-26; RoHS: Y; Value1: 1%; MountType: SMT; Supplier 1: Digi-Key; PackageReference: 0805; Tolerance_%: 1%; LatestRevisionDate: 2017-03-09; PartNumber: CRCW080539R0JNEA; ComponentLink1Description: Datasheet link; AEC Grade: N/A; Supplier Part Number 1: 541-39ACT-ND; Technology: Thin Film; ComponentLink1URL: http://www.vishay.com/docs/28705/mcx0x0xpro.pdf
R47 R48 = CMP-0015987-3: RES, 5.6, 5%, 1 W, AEC-Q200 Grade 0, 2512; PartNumber: CRCW25125R60JNEG; Manufacturer: Vishay-Dale; Value: 5.6; Value_Code: 5R60; Power_W: 1W; VDC_V: 500V; TempCo: 200 ppm/C; SizeArea_mm2: 20.16; SizeX_mm: 6.3; SizeY_mm: 3.2; SizeZ_mm: 0.71; EIA_Code: E24; AEC Category: Q200; AEC Qualified: Y; AEC Grade: 0; CompType: Resistor; PackageReference: 2512; RoHS: E; Res_ohm: 5.6; Tolerance_%: 5%; Value1: 5%; Value2: 1W; MountType: SMT; Technology: Thick Film; ComponentLink1Description: Datasheet link; ComponentLink1URL: http://www.vishay.com/docs/20035/dcrcwe3.pdf; Supplier 1: Digi-Key; Supplier Part Number 1: 541-5.6XCT-ND
R49-R52 = CMP-0021145-3: RES, 2.21, 1%, 0.125 W, AEC-Q200 Grade 0, 0805; Manufacturer: Vishay-Dale; Power_W: 125mW; TempCo: 100 ppm/C; Value_Code: 2R21; Value: 2.21; EIA_Code: E96; SizeX_mm: 2; SizeY_mm: 1.25; SizeZ_mm: 1.45; Value2: 0.125W; SizeArea_mm2: 2.5; AEC Qualified: Y; VDC_V: 150V; AEC Category: Q200; AEC Grade: 0; Supplier Part Number 2: 71-CRCW08052R21FKEA; Supplier 2: Mouser; RoHS: E; Value1: 1%; MountType: SMT; Supplier 1: Digi-Key; PackageReference: 0805; Tolerance_%: 1%; Res_ohm: 2.21; CompType: Resistor; PartNumber: CRCW08052R21FKEA; ComponentLink1Description: Datasheet link; Supplier Part Number 1: 541-2.21CCCT-ND; Technology: Thick Film; ComponentLink1URL: http://www.vishay.com/docs/20035/dcrcwe3.pdf
R53 R54 = CMP-0021932-2: RES, 4.42, 1%, 0.125 W, 0805; Manufacturer: Yageo America; Power_W: 125mW; TempCo: 200 ppm/C; Value_Code: 4R42; U/M: EA; Value: 4.42; EIA_Code: E96; SizeX_mm: 2; SizeY_mm: 1.25; SizeZ_mm: 1.45; Value2: 0.125W; SizeArea_mm2: 2.5; VDC_V: 150V; AEC Category: Q200; Supplier Part Number 2: 9237208; Publisher: Texas Instruments; Supplier 2: Farnell; Published: 2008-06-26; RoHS: Y; Value1: 1%; MountType: SMT; Supplier 1: Digi-Key; PackageReference: 0805; Tolerance_%: 1%; Res_ohm: 4.42; CompType: Resistor; LatestRevisionDate: 2017-03-09; PartNumber: RC0805FR-074R42L; AEC Qualified: ?; ComponentLink1Description: Datasheet link; Supplier Part Number 1: 311-4.42CRCT-ND; Technology: Thick Film; ComponentLink1URL: http://www.yageo.com/pdf/Pu-RC0805_51_PbFree_L_2.pdf
U9 U10 = CMP-0013424-7: 33-V Precision Surge Protection Clamp, DRV0006A (WSON-6); Manufacturer: Texas Instruments; Alternate PartNumber: TVS3300DRVT; SizeX_mm: 2; CompType: IC; SizeZ_mm: 0.8; SizeArea_mm2: 4; SizeAreaWB_mm2: 9; U/M: EA; PackageDescription: WSON-6; PartNumber: TVS3300DRVR; ComponentLink1URL: http://www.ti.com/lit/ds/symlink/tvs3300.pdf; ComponentLink1Description: Datasheet Link; SizeY_mm: 2; RoHS: Y; PackageReference: DRV0006A; MountType: SMT; Alternate Manufacturer: Texas Instruments; ComponentLink2Description: Product Folder; ComponentLink2URL: http://www.ti.com/product/tvs3300; Supplier Part Number 1: 296-47565-1-ND; Supplier 1: Digi-Key
U11 U12 = CMP-0066947-1: 4A/4A Single Channel High-speed Low-side Gate Driver, DBV0005A (SOT-23-5); Alternate PartNumber: UCC27517DBVT; Alternate Manufacturer: Texas Instruments; Green_Lifecycle: Active; SizeAreaWB_mm2: 14.82; Green_REACh: Passed; U/M: EA; SizeZ_mm: 1.45; SizeX_mm: 2.8; SizeY_mm: 2.9; SizeArea_mm2: 8.12; CompType: IC; ComponentLink1URL: http://www.ti.com/lit/ds/symlink/ucc27517.pdf; Publisher: Texas Instruments; PackageDescription: SOT-23-5; RoHS: Y; Footprint Path 6: C:\AltiumLibraries\Footprints\TI\.PcbLib; MountType: SMT; Green_EU RoHS-2: Passed; Manufacturer: Texas Instruments; Green_EU RoHS: Passed; PackageReference: DBV0005A; LatestRevisionDate: 2017-06-09; PartNumber: UCC27517DBVR; ComponentLink1Description: Datasheet Link; Supplier Part Number 1: 296-36899-1-ND; Supplier 1: Digi-Key
U13 U14 = CMP-0071431-1: High Voltage 1A Peak Half Bridge Gate Driver, 8-pin Narrow SOIC, Pb-Free; Manufacturer: Texas Instruments; PackageTopMarking: NSZXTT*L5109*BMA; CompType: MiscPower; PowerWise: N; PackageReference: D0008A; PinCount: 8; PackageDescription: SOIC Narrow, 4.9 x 3.9 x 1.45mm, 8 Lead, 1.27mm Pitch; Code_JEDEC: MS-012-AA; Code_IPC: SOIC127P600-8; RoHS: Y; ComponentLink1Description: Datasheet URL; ComponentLink1URL: http://www.ti.com/general/docs/lit/getliterature.tsp?genericPartNumber=LM5109B&fileType=pdf; PartNumber: LM5109BMA/NOPB; Supplier Part Number 1: LM5109BMA/NOPB-ND; Supplier 1: Digi-Key